# Altium schematic sheet 8_DBUS.schdoc.schdoc
size 309 x 223 mm; Symbol: Sheet-Symbol_A4; Device: Sheet-Symbol_A4; @Page Name: DBUS; @Create Date: 2023-12-01; @Page Count: 9; @Page No: 9; @Project Name: STM32F722RET6; @Schematic Name: 开发板; @Update Date: 2023-12-01; Company: 嘉立创EDA; Page Size: A4; Version: V1.0
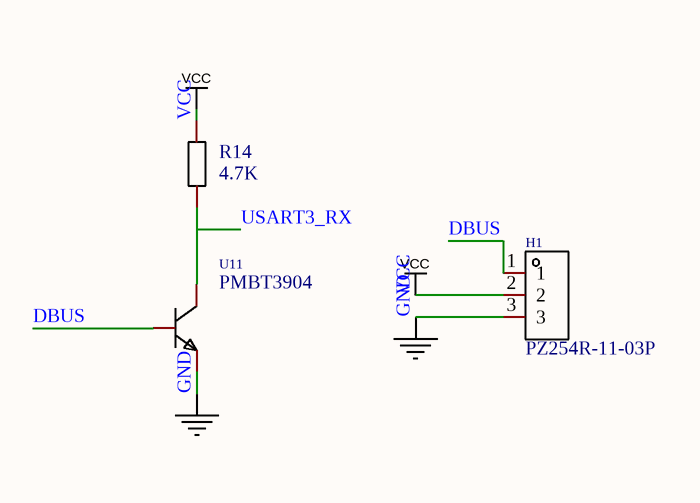
[diagram p0: 8_DBUS.schdoc.schdoc]

## Parts
H1  PZ254R-11-03P  [HDR-TH_3P-P2.54-H-M-W10.4]
R14  4.7K  [R0603]
U11  PMBT3904  [SOT-23-3_L2.9-W1.3-P1.90-LS2.4-BR]

## Nets
GND: H1.3 U11.2(E)
VCC: H1.2 R14.1
DBUS: H1.1 U11.1(B)
USART3_RX: R14.2 U11.3(C)

## Notes on the sheet
- 1
- 2
- 3
- 4
- 5
- 6
- A
- B
- C
- 原理图
- 开发板
- 创建日期
- 更新日期
- 2023-12-01
- 审阅
- 绘制
- 图页
- DBUS
- 物料编码
- STM32F722RET6
- D
- 版本
- 尺寸
- 页
- 9
- 共
- V1.0
- A4
- 嘉立创EDA

## Library data of the parts
H1 = PZ254R-11-03P: 排数:单排;总PIN位数:3P;间距:2.54mm;插针结构:1x3P;行距:-;安装类型:弯插;圆针/方针:方针;额定电流:-;额定电压:-;配合针长度:6mm;塑高:2.5mm;触头材质:黄铜;触头镀层:-;工作温度范围:-40℃~+105℃;颜色:黑色;; Manufacturer: XFCN(兴飞); Add into BOM: yes; Pitch: 2.54mm; Pin Structure: 1x3P; Circluar Pins/Square Pins: 方针; Name: PZ254R-11-03P; Symbol: PZ254R-11-03P; Device: PZ254R-11-03P; LCSC Part Name: 2.54mm 1x3P 弯插 方针; Supplier Part: C492411; Manufacturer Part: PZ254R-11-03P; Supplier Footprint: 弯插,P=2.54mm; JLCPCB Part Class: Extended Part; Datasheet: https://atta.szlcsc.com/upload/public/pdf/source/20200309/C492411_5256E8AAA7569F6D33B6ADBFAE4F2888.pdf; Supplier: LCSC; Convert to PCB: yes; Number of Rows: 单排; Number of Pins: 3P; Row Spacing: -; Mounting Type: 弯插; Current Rating (Max): -; Voltage Rating (Max): -; Length of Mating Pin: 6mm; Insulation Height: 2.5mm; Contact Material: 黄铜; Contact Plating: -; Operating Temperature Range: -40℃~+105℃; Color: 黑色
R14 = Res_0603: Symbol: 电阻; Convert to PCB: yes; Name: 4.7K; Device: Res_0603; Add into BOM: yes; Supplier Footprint: 0603; Value: 4.7K
U11 = PMBT3904: Manufacturer: PAKER(派克微); Add into BOM: yes; Name: PMBT3904; Symbol: PMBT3904; Device: PMBT3904; LCSC Part Name: PMBT3904; Supplier Part: C5278868; Manufacturer Part: PMBT3904; Supplier Footprint: SOT-23; JLCPCB Part Class: Extended Part; Supplier: LCSC; Convert to PCB: yes